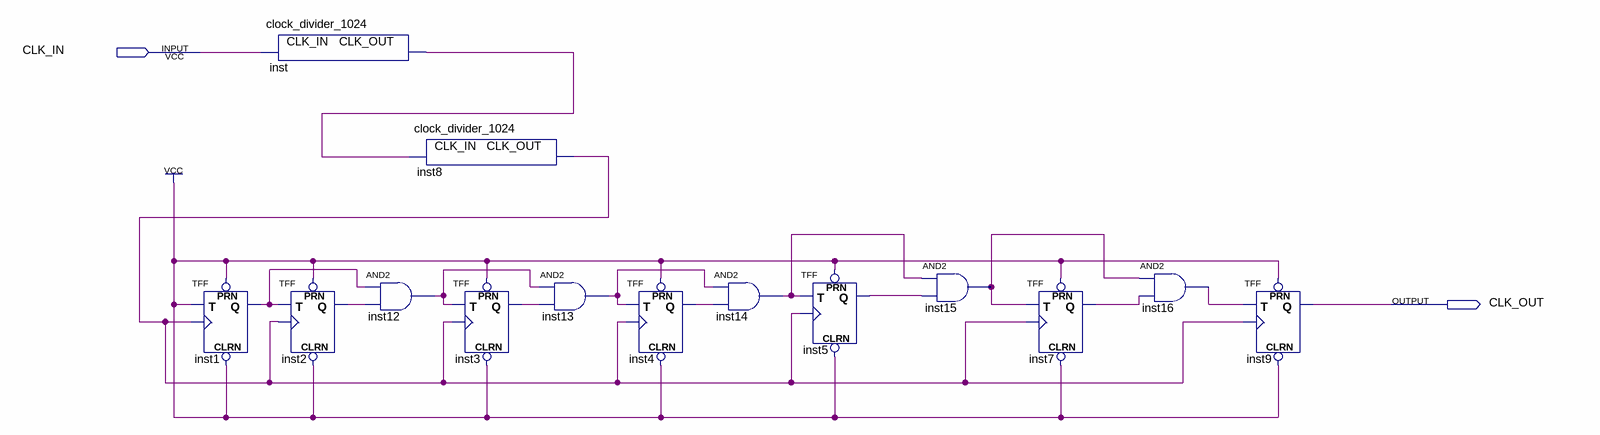
[diagram p0: schematic sheet]
// Quartus schematic clock_generator.bdf as structural Verilog: 14 symbols, 2 pins
module clock_generator (
  input  CLK_IN,
  output CLK_OUT
);

  wire inst1_q, inst2_q, inst3_q, inst4_q, inst5_q, inst7_q, inst8_clk_out, inst12_out, inst13_out,
       inst14_out, inst15_out, inst16_out, inst_clk_out;

  TFF inst1 (.PRN(1'b1), .CLRN(1'b1), .T(1'b1), .CLK(inst8_clk_out), .Q(inst1_q));
  clock_divider_1024 inst (.CLK_IN(CLK_IN), .CLK_OUT(inst_clk_out));
  TFF inst2 (.PRN(1'b1), .CLRN(1'b1), .T(inst1_q), .CLK(inst8_clk_out), .Q(inst2_q));
  and inst12 (inst12_out, inst1_q, inst2_q);
  clock_divider_1024 inst8 (.CLK_IN(inst_clk_out), .CLK_OUT(inst8_clk_out));
  TFF inst3 (.PRN(1'b1), .CLRN(1'b1), .T(inst12_out), .CLK(inst8_clk_out), .Q(inst3_q));
  and inst13 (inst13_out, inst12_out, inst3_q);
  TFF inst4 (.PRN(1'b1), .CLRN(1'b1), .T(inst13_out), .CLK(inst8_clk_out), .Q(inst4_q));
  and inst14 (inst14_out, inst13_out, inst4_q);
  TFF inst5 (.PRN(1'b1), .CLRN(1'b1), .T(inst14_out), .CLK(inst8_clk_out), .Q(inst5_q));
  and inst15 (inst15_out, inst14_out, inst5_q);
  TFF inst7 (.PRN(1'b1), .CLRN(1'b1), .T(inst15_out), .CLK(inst8_clk_out), .Q(inst7_q));
  and inst16 (inst16_out, inst15_out, inst7_q);
  TFF inst9 (.PRN(1'b1), .CLRN(1'b1), .T(inst16_out), .CLK(inst8_clk_out), .Q(CLK_OUT));
endmodule
